# Altium project Konfident.PrjPcb
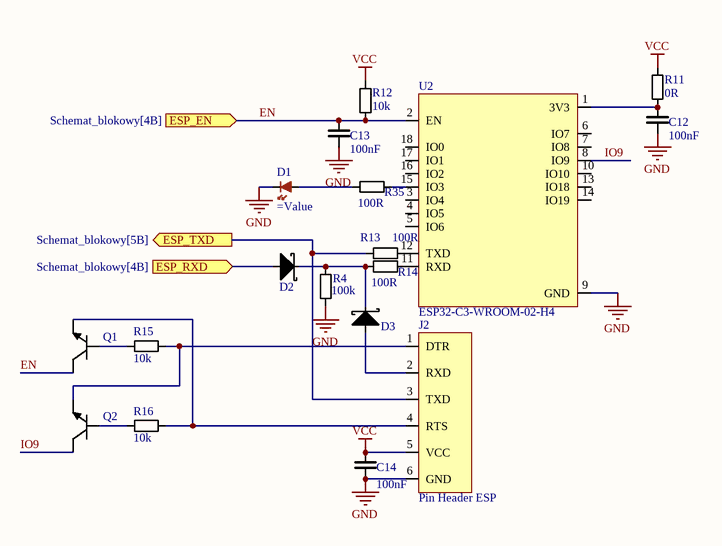
[diagram p0: ESP-WiFi.SchDoc]
projGroupName: Niedzielni; projLocalName: Konfident; projSheetTotal: 8
2 sheets, 20 parts. Net scope: flat (ports and power ports of the same name join across sheets).
Board file: PCB3.PcbDoc
Sheets:
  ESP-WiFi.SchDoc
  Wyswietlacz.SchDoc

## Sheet ESP-WiFi.SchDoc
size 292 x 193 mm; Opracowal: Krzysztof Dobosz; projRevision: MS; CompanyName: Politechnika Warszawska; Organization: EITI; Address1: Nowowiejska 15/19; Address2: 00-665 Warszawa; Revision: MS; SheetNumber: 3; SheetTotal: 8; HTTPLink: www.pw.edu.pl; Group_Name: Niedzielni; ProjName: Konfident

### Parts
C12  100nF  [0603_CAP]
C13  100nF  [0603_CAP]
C14  100nF  [0603_CAP]
D1  (no value)  [0603_LED_R_Reflow]
D2  (no value)  [SOT23-R]
D3  (no value)  [SOT23-R]
J2  Pin Header ESP  [SAMTEC_TSW-112-16-T-S-06]
Q1  NPN  [SOT95P240X110-3N]  (value not drawn)
Q2  NPN  [SOT95P240X110-3N]  (value not drawn)
R4  100k  [0603_RES]
R11  0R  [0603_RES]
R12  10k  [0603_RES]
R13  100R  [0603_RES]
R14  100R  [0603_RES]
R15  10k  [0603_RES]
R16  10k  [0603_RES]
R35  100R  [0603_RES]
U2  ESP32-C3-WROOM-02-H4  [MODULE_ESP32-C3-WROOM-02-H4]

### Ports
ESP_EN (in, see Schemat_blokowy[4B]), ESP_RXD (in, see Schemat_blokowy[4B]), ESP_TXD (out, see Schemat_blokowy[5B])

### Nets
GND: C12.1 C13.1 C14.1 D1.2(K) J2.6(GND) R4.1 U2.9(GND)
VCC: C14.2 J2.5(VCC) R11.2 R12.2
EN: C13.2 Q1.3(C) R12.1 U2.2(EN) ; port ESP_EN
IO9: Q2.3(C) U2.8(IO9)
NetC12_2: C12.2 R11.1 U2.1(3V3)
NetD1_1: D1.1(A) R35.1
NetD2_1: D2.1(A) ; port ESP_RXD
NetD2_3: D2.3(K) D3.3(K) R4.2 R14.1
NetD3_1: D3.1(A) J2.2(RXD)
NetJ2_1: J2.1(DTR) Q2.2(E) R15.1
NetJ2_3: J2.3(TXD) R13.1 ; port ESP_TXD
NetJ2_4: J2.4(RTS) Q1.2(E) R16.1
NetQ1_1: Q1.1(B) R15.2
NetQ2_1: Q2.1(B) R16.2
NetR13_2: R13.2 U2.12(TXD)
NetR14_2: R14.2 U2.11(RXD)
NetR35_2: R35.2 U2.15(IO3)

Not connected (* = marked no-connect by the designer): U2 3(IO4) 4(IO5) 5(IO6) 6(IO7) 7(IO8) 10(IO10) 13(IO18) 14(IO19) 16(IO2) 17(IO1) 18(IO0)

### Notes on the sheet
- Data:
- Tytuł:
- Rev.:
- Rozm.:
- A4
- Strona:
- z
- PBL4
- Opracował:

### Library data of the parts
C12-C14 = Cap: Ceramic capacitor; Value: 100nF
D1 = LED_R_small: Red LED diode; PartNumber: APT1608SURC; Link: https://www.mouser.pl/ProductDetail/Kingbright/APT1608SURC?qs=SxaZfIVsCL1abw2IbECoZw%3D%3D
D2 D3 = D Schottky: Schottky Diode; PartNumber: BAT54C; Link: https://www.digikey.pl/en/products/detail/diotec-semiconductor/BAT54C/13163831
Q1 Q2 = NPN: NPN General-purpose Transistor; PartNumber: BC848C-7-F; Link: https://www.digikey.pl/en/products/detail/diodes-incorporated/BC848C-7-F/1934460?s=N4IgTCBcDaIEIGEAcAWJCC0B2DAxEAugL5A
R4 R11-R16 R35 = RES: Resistor
  R4: Value: 100k
  R11: Value: 0R
  R12 R15 R16: Value: 10k
  R13 R14 R35: Value: 100R
U2 = ESP32-C3-WROOM-02-H4: WiFi Modules (802.11) (Engineering Samples) SMD module, ESP32-C3, 4MB SPI flash, PCB antenna, -40 C +105 C; MF: Espressif Systems; MP: ESP32-C3-WROOM-02-H4; Package: Package; Purchase-URL: https://pricing.snapeda.com/search/part/ESP32-C3-WROOM-02-H4/?ref=eda; Check_prices: https://www.snapeda.com/parts/ESP32-C3-WROOM-02-H4/Espressif+Systems/view-part/?ref=eda; SnapEDA_Link: https://www.snapeda.com/parts/ESP32-C3-WROOM-02-H4/Espressif+Systems/view-part/?ref=snap; Price: None; Availability: In Stock; Value: *; PartNumber: ESP32-C3-WROOM-02-H4

## Sheet Wyswietlacz.SchDoc
size 292 x 193 mm; Opracowal: Mieszko Mazurkiewicz; projRevision: MS; Author: Mieszko Mazurkiewicz; CompanyName: Politechnika Warszawska; Organization: EITI; Address1: Nowowiejska 15/19; Address2: 00-665 Warszawa; Revision: MS; SheetNumber: 8; SheetTotal: 8; HTTPLink: www.pw.edu.pl; Group_Name: Niedzielni; ProjName: Konfident
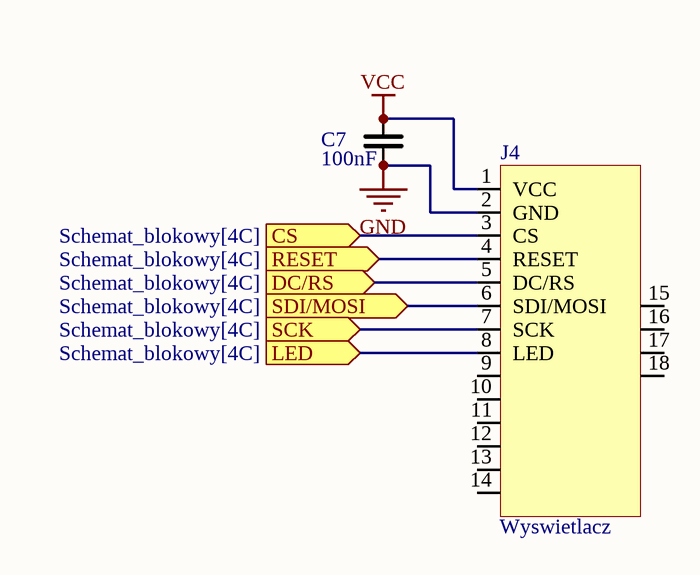
[diagram p1: Wyswietlacz.SchDoc]

### Parts
C7  100nF  [0603_CAP]
J4  Wyswietlacz  [pin_header_LCD]

### Ports
CS (in, see Schemat_blokowy[4C]), DC/RS (in, see Schemat_blokowy[4C]), LED (in, see Schemat_blokowy[4C]), RESET (in, see Schemat_blokowy[4C]), SCK (in, see Schemat_blokowy[4C]), SDI/MOSI (in, see Schemat_blokowy[4C])

### Nets
GND: C7.1 J4.2(GND)
VCC: C7.2 J4.1(VCC)
NetJ4_3: J4.3(CS) ; port CS
NetJ4_4: J4.4(RESET) ; port RESET
NetJ4_5: J4.5(DC/RS) ; port DC/RS
NetJ4_6: J4.6(SDI/MOSI) ; port SDI/MOSI
NetJ4_7: J4.7(SCK) ; port SCK
NetJ4_8: J4.8(LED) ; port LED

Not connected (* = marked no-connect by the designer): J4 9 10 11 12 13 14 15 16 17 18

### Notes on the sheet
- Data:
- Tytuł:
- Rev.:
- Rozm.:
- A4
- Strona:
- z
- PBL4
- Opracował:

### Library data of the parts
C7 = Cap: Ceramic capacitor; Value: 100nF
J4 = Pin Header Wyswietlacz: Dispaly; PartNumber: ILI9486

## Nets that join several sheets
GND: ESP-WiFi (7 pins), Wyswietlacz (C7.1 J4.2)
VCC: ESP-WiFi (C14.2 J2.5 R11.2 R12.2), Wyswietlacz (C7.2 J4.1)